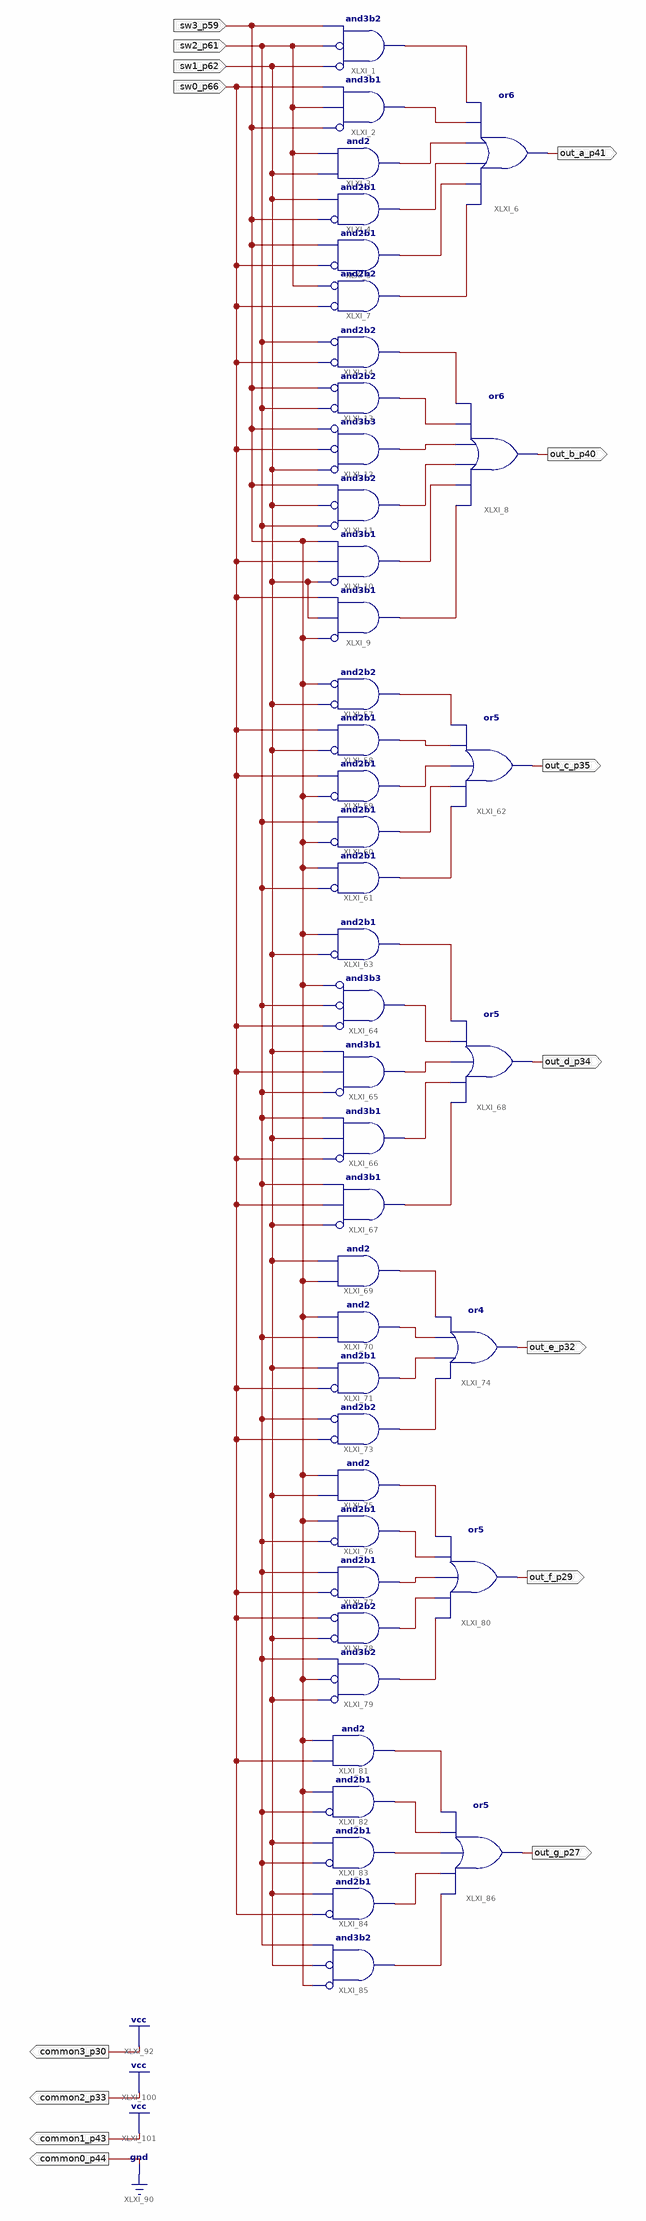
[diagram p0: schematic sheet 1]
// Xilinx ISE schematic binary_4_bit_to_7_segment_1_digit.sch (spartan6) as structural Verilog: 43 symbols, 15 ports
module binary_4_bit_to_7_segment_1_digit (
  input  sw2_p61,
  input  sw3_p59,
  input  sw0_p66,
  input  sw1_p62,
  output out_a_p41,
  output out_b_p40,
  output out_c_p35,
  output out_d_p34,
  output out_e_p32,
  output out_f_p29,
  output out_g_p27,
  output common3_p30,
  output common2_p33,
  output common1_p43,
  output common0_p44
);

  wire XLXN_1, XLXN_2, XLXN_3, XLXN_4, XLXN_5, XLXN_6, XLXN_9, XLXN_10, XLXN_11, XLXN_12, XLXN_13, XLXN_14,
       XLXN_108, XLXN_109, XLXN_110, XLXN_111, XLXN_112, XLXN_133, XLXN_134, XLXN_135, XLXN_136, XLXN_137,
       XLXN_148, XLXN_149, XLXN_150, XLXN_151, XLXN_165, XLXN_166, XLXN_167, XLXN_168, XLXN_169, XLXN_184,
       XLXN_185, XLXN_186, XLXN_187, XLXN_188;

  and XLXI_1 (XLXN_1, ~sw1_p62, ~sw2_p61, sw3_p59);  // and3b2
  and XLXI_2 (XLXN_2, ~sw3_p59, sw2_p61, sw0_p66);  // and3b1
  and XLXI_3 (XLXN_3, sw1_p62, sw2_p61);
  and XLXI_4 (XLXN_4, ~sw3_p59, sw1_p62);  // and2b1
  and XLXI_5 (XLXN_5, ~sw0_p66, sw3_p59);  // and2b1
  or XLXI_6 (out_a_p41, XLXN_6, XLXN_5, XLXN_4, XLXN_3, XLXN_2, XLXN_1);
  and XLXI_7 (XLXN_6, ~sw0_p66, ~sw2_p61);  // and2b2
  or XLXI_8 (out_b_p40, XLXN_9, XLXN_10, XLXN_11, XLXN_12, XLXN_13, XLXN_14);
  and XLXI_9 (XLXN_9, ~sw3_p59, sw1_p62, sw0_p66);  // and3b1
  and XLXI_10 (XLXN_10, ~sw1_p62, sw0_p66, sw3_p59);  // and3b1
  and XLXI_11 (XLXN_11, ~sw2_p61, ~sw1_p62, sw3_p59);  // and3b2
  and XLXI_12 (XLXN_12, ~sw1_p62, ~sw0_p66, ~sw3_p59);  // and3b3
  and XLXI_13 (XLXN_13, ~sw2_p61, ~sw3_p59);  // and2b2
  and XLXI_14 (XLXN_14, ~sw0_p66, ~sw2_p61);  // and2b2
  and XLXI_57 (XLXN_108, ~sw1_p62, ~sw3_p59);  // and2b2
  and XLXI_58 (XLXN_109, ~sw1_p62, sw0_p66);  // and2b1
  and XLXI_59 (XLXN_110, ~sw3_p59, sw0_p66);  // and2b1
  and XLXI_60 (XLXN_111, ~sw3_p59, sw2_p61);  // and2b1
  and XLXI_61 (XLXN_112, ~sw2_p61, sw3_p59);  // and2b1
  or XLXI_62 (out_c_p35, XLXN_112, XLXN_111, XLXN_110, XLXN_109, XLXN_108);
  and XLXI_63 (XLXN_133, ~sw1_p62, sw3_p59);  // and2b1
  and XLXI_64 (XLXN_134, ~sw0_p66, ~sw2_p61, ~sw3_p59);  // and3b3
  and XLXI_65 (XLXN_135, ~sw2_p61, sw0_p66, sw1_p62);  // and3b1
  and XLXI_66 (XLXN_136, ~sw0_p66, sw1_p62, sw2_p61);  // and3b1
  and XLXI_67 (XLXN_137, ~sw1_p62, sw0_p66, sw2_p61);  // and3b1
  or XLXI_68 (out_d_p34, XLXN_137, XLXN_136, XLXN_135, XLXN_134, XLXN_133);
  and XLXI_69 (XLXN_148, sw3_p59, sw1_p62);
  and XLXI_70 (XLXN_149, sw2_p61, sw3_p59);
  and XLXI_71 (XLXN_150, ~sw0_p66, sw1_p62);  // and2b1
  and XLXI_73 (XLXN_151, ~sw0_p66, ~sw2_p61);  // and2b2
  or XLXI_74 (out_e_p32, XLXN_151, XLXN_150, XLXN_149, XLXN_148);
  and XLXI_75 (XLXN_165, sw1_p62, sw3_p59);
  and XLXI_76 (XLXN_166, ~sw2_p61, sw3_p59);  // and2b1
  and XLXI_77 (XLXN_167, ~sw0_p66, sw2_p61);  // and2b1
  and XLXI_78 (XLXN_168, ~sw1_p62, ~sw0_p66);  // and2b2
  and XLXI_79 (XLXN_169, ~sw1_p62, ~sw3_p59, sw2_p61);  // and3b2
  or XLXI_80 (out_f_p29, XLXN_169, XLXN_168, XLXN_167, XLXN_166, XLXN_165);
  and XLXI_81 (XLXN_184, sw0_p66, sw3_p59);
  and XLXI_82 (XLXN_185, ~sw2_p61, sw3_p59);  // and2b1
  and XLXI_83 (XLXN_186, ~sw2_p61, sw1_p62);  // and2b1
  and XLXI_84 (XLXN_187, ~sw0_p66, sw1_p62);  // and2b1
  and XLXI_85 (XLXN_188, ~sw3_p59, ~sw1_p62, sw2_p61);  // and3b2
  or XLXI_86 (out_g_p27, XLXN_188, XLXN_187, XLXN_186, XLXN_185, XLXN_184);

  assign common0_p44 = 1'b0;
  assign common1_p43 = 1'b1;
  assign common2_p33 = 1'b1;
  assign common3_p30 = 1'b1;
endmodule
